# EAGLE design main (EAGLE 9.6.2)
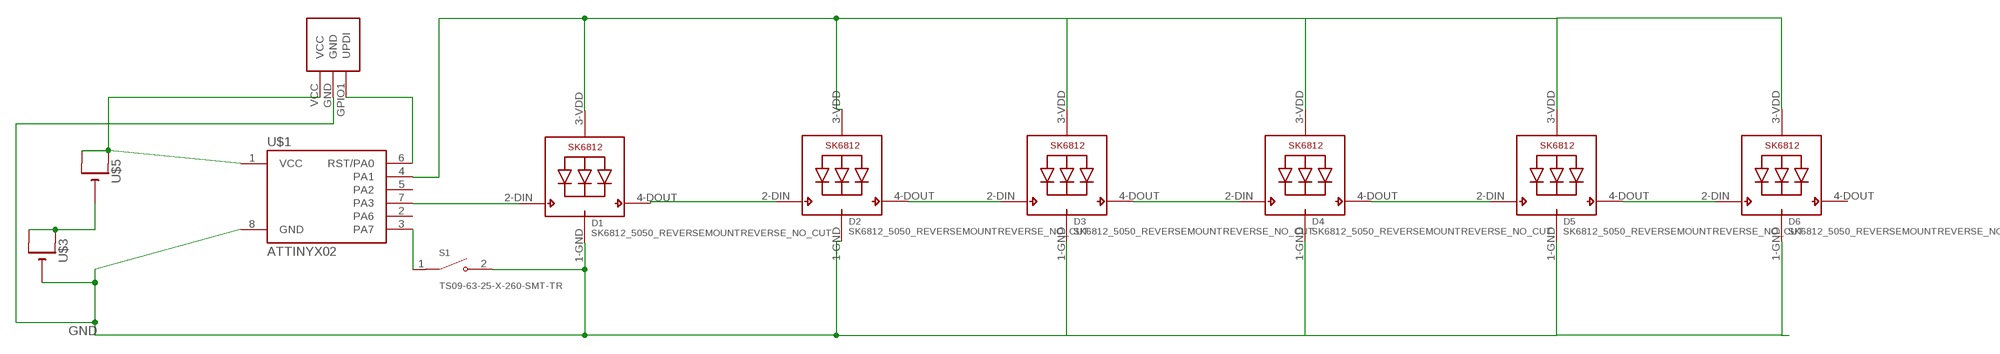
[diagram p0: schematic, sheet 1]

## Parts
D1  SK6812_5050_REVERSEMOUNTREVERSE_NO_CUT  [SK6812_REVERSE_NO_CUT]
D2  SK6812_5050_REVERSEMOUNTREVERSE_NO_CUT  [SK6812_REVERSE_NO_CUT]
D3  SK6812_5050_REVERSEMOUNTREVERSE_NO_CUT  [SK6812_REVERSE_NO_CUT]
D4  SK6812_5050_REVERSEMOUNTREVERSE_NO_CUT  [SK6812_REVERSE_NO_CUT]
D5  SK6812_5050_REVERSEMOUNTREVERSE_NO_CUT  [SK6812_REVERSE_NO_CUT]
D6  SK6812_5050_REVERSEMOUNTREVERSE_NO_CUT  [SK6812_REVERSE_NO_CUT]
S1  TS09-63-25-X-260-SMT-TR  [SW_TS09-63-25-X-260-SMT-TR]
U$1  ATTINYX02  [SOIC08_JEDEC_150MIL]
U$2  SAO  [SAO_SMD]
U$3  CR2032SMT  [CR2032-SMD]
U$5  CR2032SMT  [CR2032-SMD]

## Nets
GND: D1.1-GND(GND) D2.1-GND(GND) D3.1-GND(GND) D4.1-GND(GND) D5.1-GND(GND) D6.1-GND(GND) S1.2 U$1.8(GND) U$2.GND U$3.-
N$2: D1.4-DOUT(DO) D2.2-DIN(DI)
N$3: D1.2-DIN(DI) U$1.7(PA3)
N$5: D3.4-DOUT(DO) D4.2-DIN(DI)
N$6: D2.4-DOUT(DO) D3.2-DIN(DI)
N$7: S1.1 U$1.3(PA7)
N$8: D4.4-DOUT(DO) D5.2-DIN(DI)
N$9: D5.4-DOUT(DO) D6.2-DIN(DI)
N$10: U$3.+$1(+) U$3.+$2(+1) U$5.-
N$110: U$1.6(RST/PA0) U$2.GPIO1(UPDI)
VCC1: U$1.1(VCC) U$2.VCC U$5.+$1(+) U$5.+$2(+1)
VDD1: D1.3-VDD(VDD) D2.3-VDD(VDD) D3.3-VDD(VDD) D4.3-VDD(VDD) D5.3-VDD(VDD) D6.3-VDD(VDD) U$1.4(PA1)
Unconnected: D6.4-DOUT(DO) U$1.2(PA6) U$1.5(PA2)

## Library data of the parts
D1-D6 = mylibrary:SK6812_5050_REVERSEMOUNT
S1 = mylibrary:TS09-63-25-X-260-SMT-TR; MANUFACTURER: CUI Devices; MAXIMUM_PACKAGE_HEIGHT: 2.5 mm; PARTREV: 1.0; STANDARD: Manufacturer Recommendations
U$1 = mylibrary:ATTINYX02
U$2 = mylibrary:SAO
U$3 U$5 = adafruit:CR2032

## Board
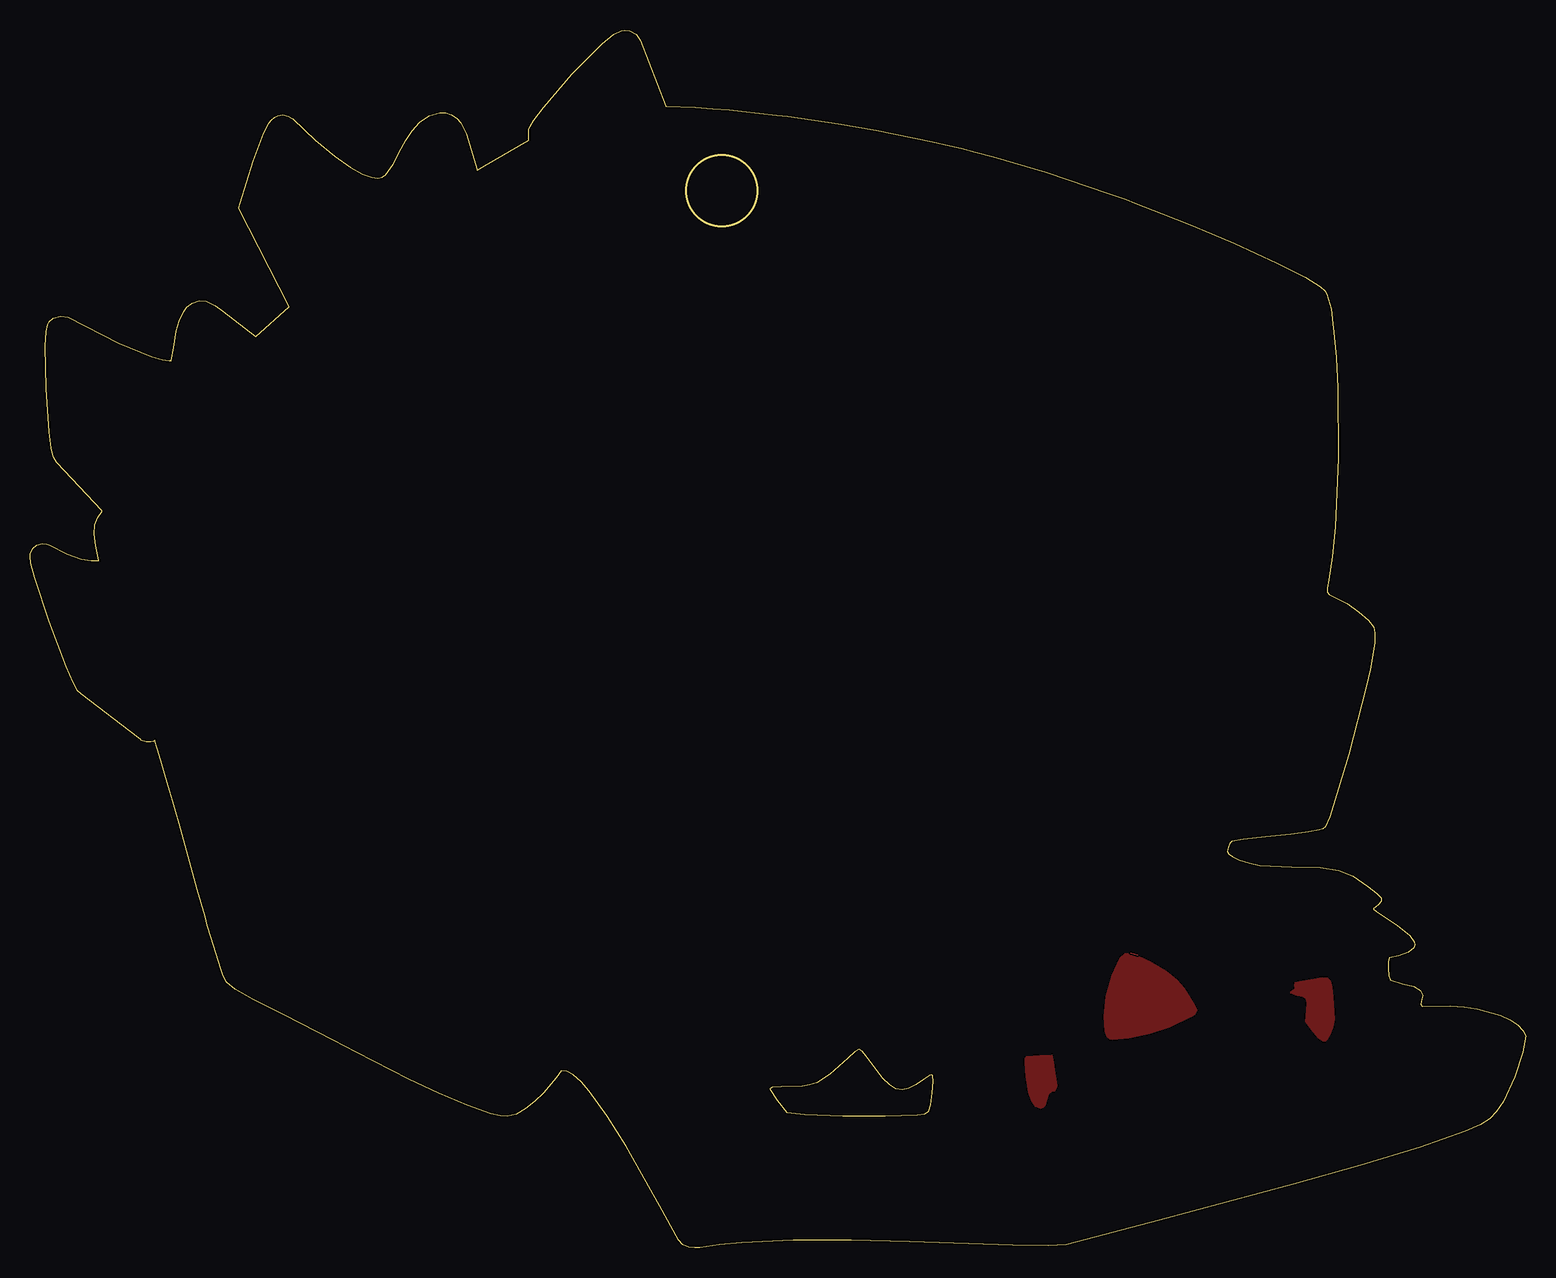
[diagram p1: board, top side]
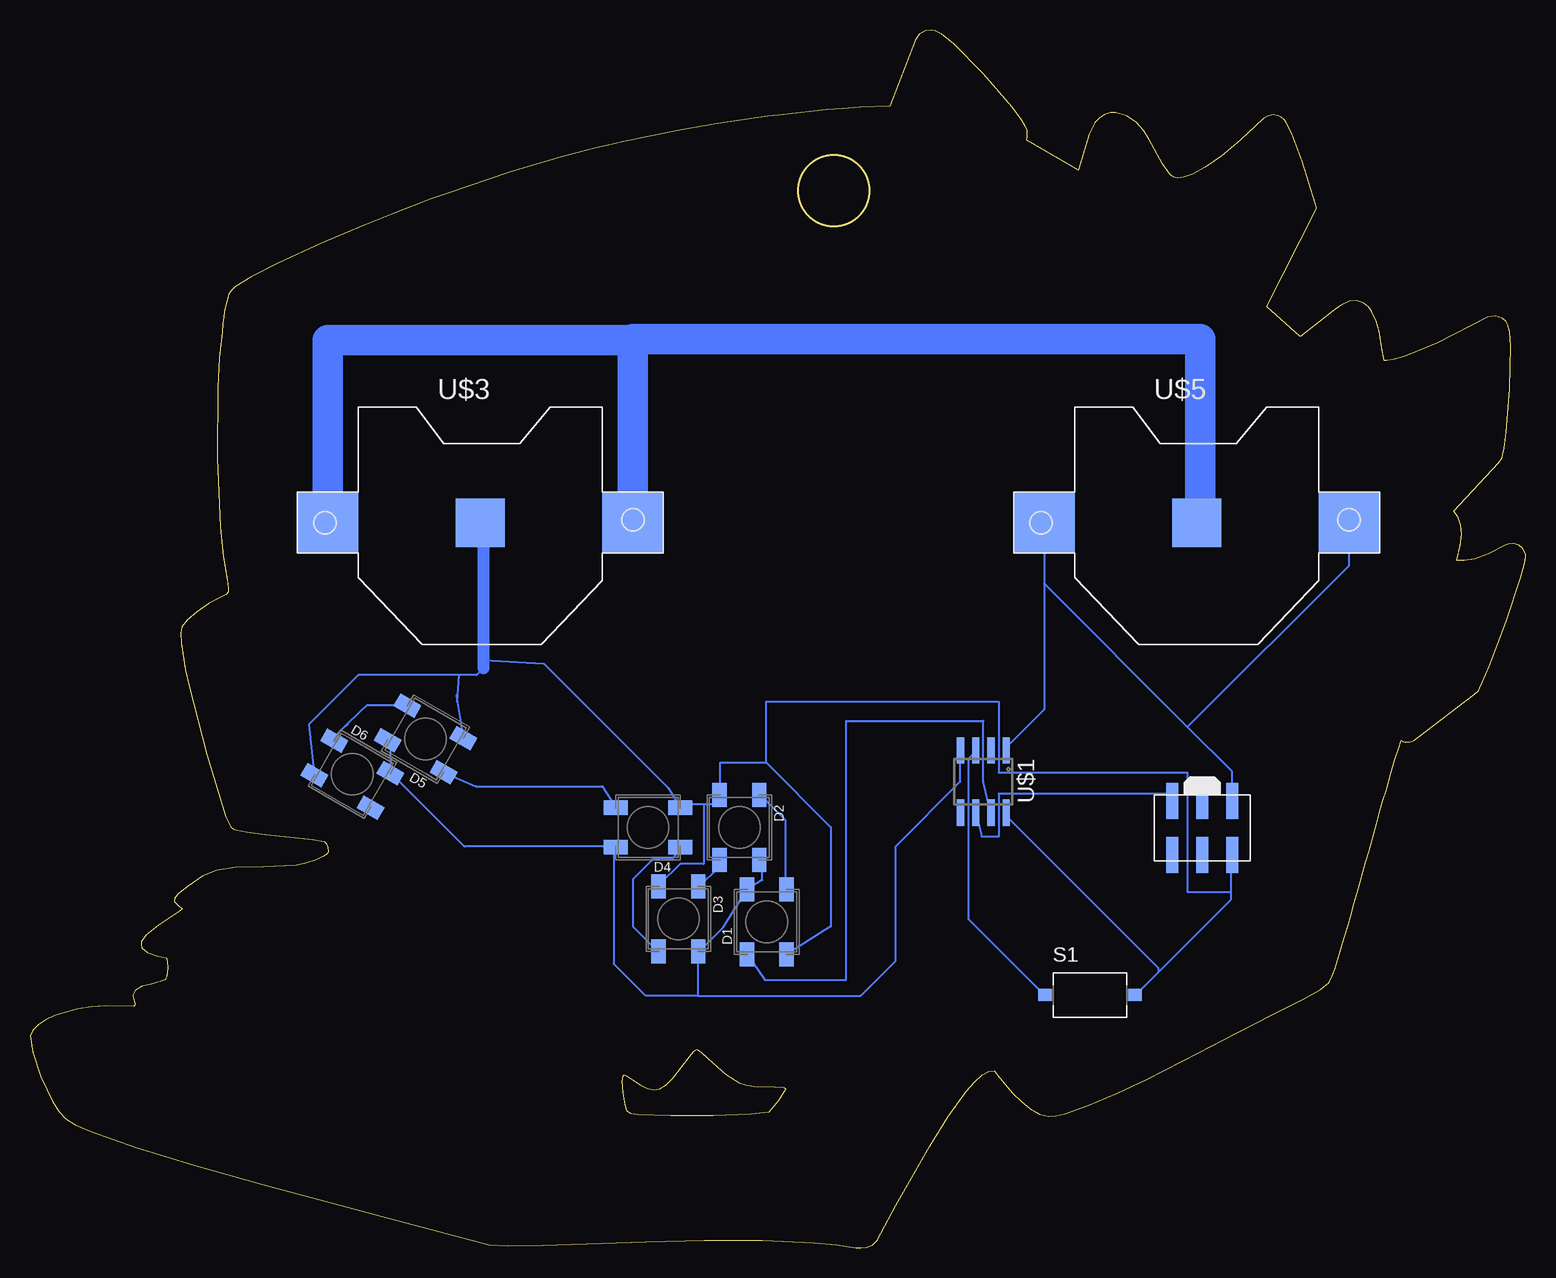
[diagram p2: board, bottom side, seen from below]

Size 124.64 x 101.54 mm. Coordinates in mm from the lower left corner, seen from the top.
Outline: 49.55,101.54 49.25,101.48 48.64,101.19 47.67,100.39 45.2,97.88 42.8,95.12 41.99,94.02 41.71,93.53 41.56,93.23 41.54,92.61 41.58,92.37 37.91,90.23 37.27,89.84 36.35,92.88 35.9,93.82 35.56,94.2 35.12,94.48 34.64,94.64 34.15,94.65 33.28,94.4 32.46,93.84 31.84,93.15 31.35,92.4 30.96,91.65 30.25,90.33 29.63,89.5 29.34,89.29 29,89.19 28.5,89.26 27.75,89.54 26.7,90.1 25.38,91.03 23.78,92.36 21.88,94.13 21.51,94.36 21.05,94.47 20.65,94.4 20.38,94.26 20.09,94.01 19.94,93.8 19.49,92.94 18.62,90.59 17.53,87.12 17.4,86.69 21.59,78.49 18.81,75.97 16.08,78.09 15.45,78.58 14.68,78.93 14.11,78.97 13.51,78.78 13.08,78.44 12.82,78.07 12.44,77.25 12.2,76.45 11.99,75.05 11.79,73.97 11.59,73.96 11.03,74.04 10.14,74.29 7.38,75.45 3.18,77.59 2.55,77.69 1.93,77.52 1.62,77.22 1.49,76.99 1.34,76.4 1.26,75.18 1.34,71.66 1.61,68.01 1.79,66.67 1.9,66.16 1.96,65.91 2.25,65.5 6,61.46 5.63,60.91 5.4,60.28 5.34,59.52 5.46,58.56 5.75,57.32 5.12,57.3 4.25,57.45 3.11,57.85 1.66,58.6 1.41,58.7 1.03,58.74 0.57,58.6 0.24,58.32 0.01,57.87 0,57.63 0.06,57.1 0.39,55.88 1.62,52.24 3.04,48.49 3.6,47.16 3.84,46.7 3.93,46.5 4.25,46.18 9.06,42.53 9.22,42.41 9.29,42.33 9.67,42.2 9.9,42.18 10.07,42.19 10.26,42.24 10.39,42.32 10.59,41.66 10.9,40.69 11.24,39.51 11.63,38.1 11.91,37.26 12.16,36.39 12.42,35.4 13.04,33.08 13.31,32.17 13.94,29.9 14.27,28.77 14.59,27.63 14.79,26.88 15.11,25.85 15.89,23.32 16.11,22.68 16.39,22.13 17.09,21.55 18.56,20.73 21.16,19.42 25.28,17.31 27.19,16.29 31.58,14.07 34.07,12.89 36.44,11.88 38.41,11.18 39.18,11 39.76,10.96 40.51,11.16 41.29,11.61 42.05,12.22 42.75,12.91 43.85,14.18 44.28,14.75 44.74,14.74 45.29,14.42 45.92,13.85 46.61,13.06 48.11,10.98 49.67,8.49 52.48,3.53 54.04,0.65 54.41,0.28 54.9,0.08 55.4,0 55.82,0.03 57.43,0.28 59.3,0.46 63.62,0.64 68.42,0.64 73.32,0.54 81.9,0.24 84.84,0.19 86.37,0.29 94.09,2.33 105.29,5.31 110.9,6.89 115.84,8.4 119.59,9.72 120.87,10.28 121.65,10.76 122.21,11.36 122.75,12.21 123.73,14.28 124.41,16.32 124.64,17.7 124.41,18.16 123.97,18.61 123.34,19.02 122.55,19.38 120.6,19.94 119.5,20.1 118.35,20.17 116.01,20.13 115.88,20.33 115.94,20.56 116.07,21.06 115.87,21.47 115.32,21.79 114.42,22.03 113.37,22.35 113.24,22.7 113.18,23.31 113.18,23.89 113.28,24.17 114.06,24.35 114.87,24.63 115.31,25.02 115.38,25.26 115.35,25.51 114.99,26.07 113.93,26.89 112.81,27.63 112.19,28.05 111.94,28.27 112.34,28.61 112.61,28.9 112.6,29.18 112.24,29.56 111.49,30.15 110.23,31.02 109.07,31.5 107.54,31.71 105.15,31.78 102.47,31.91 101.59,32.09 100.79,32.37 100.19,32.63 99.88,32.84 99.78,33.07 99.84,33.39 99.96,33.71 100.14,33.9 101.09,34.07 102.99,34.27 105.04,34.49 106.55,34.69 107.45,34.87 107.72,34.95 107.92,35.11 108.31,35.94 109.91,41.13 111.36,46.79 111.69,48.25 112.05,50.44 112.08,51.26 111.99,51.76 111.53,52.36 110.74,53.04 109.75,53.71 108.69,54.28 108.29,54.47 108.11,54.68 108.1,55.03 108.22,55.67 108.53,57.66 108.77,60.12 109.03,65.85 109,71.67 108.86,74.23 108.63,76.37 108.58,77.05 108.42,78.25 108.07,79.53 107.88,79.82 107.54,80.14 106.26,80.95 103.96,82.11 100.35,83.76 98.46,84.56 96.68,85.32 94.36,86.24 92.12,87.12 91.31,87.43 89.93,87.91 84.67,89.67 80.27,90.99 78.81,91.36 77.6,91.68 76.63,91.91 75.2,92.24 70.5,93.21 67.37,93.75 63.16,94.34 62.25,94.45 59.33,94.77 58.25,94.88 56.9,94.99 55.45,95.09 52.98,95.2 50.87,100.68 50.53,101.17 50,101.49 49.55,101.54
Outline: 49.55,101.54 49.55,101.54
Outline: 61.85,13.41 61.65,13.29 62.26,12.33 63.07,11.32 64.56,11.14 67.71,11.03 71.26,11.01 73.94,11.11 74.56,11.19 74.88,11.39 75.05,11.92 75.18,12.95 75.27,13.91 75.22,14.37 75.13,14.43 74.98,14.39 74.49,14.07 73.81,13.6 73.21,13.3 72.67,13.19 72.16,13.29 71.64,13.6 71.07,14.14 69.68,15.96 69.35,16.41 69.08,16.55 68.74,16.36 68.15,15.83 66.67,14.5 65.54,13.78 64.98,13.6 64.33,13.49 62.6,13.44 61.85,13.41
Outline: circle at 57.65,88.15 radius 2.96
Copper layers (1*16): Top 0.035mm / dielectric 1.5mm / Bottom 0.035mm
Design rules "default": minimum track width 6mil, minimum drill 0.35mm, track to track 6mil, track to pad 6mil, pad to pad 6mil, via to via 6mil, smd to smd 6mil, copper to edge 40mil, drill to drill 6mil, minimum pad ring 10mil, minimum via ring 8mil, stop-mask expansion 4mil, vias tented up to drill 0mil, thermal gap 10mil
bRestrict: area 61.7,25.6 to 65.3,29.2; area 71.3,33.3 to 74.9,36.9; area 68.8,25.6 to 72.4,29.2; area 89.9,40.6 to 93.5,44.2; area 95.7,37.6 to 99.3,41.2

### Footprints (pad centres in the part's own frame; a part is rotated, then mirrored left to right if it is on the bottom)
SK6812_REVERSE_NO_CUT = smd 2 x 1.2: 1-GND -2.7,-1.65; 2-DIN -2.7,1.65; 3-VDD 2.7,1.65; 4-DOUT 2.7,-1.65
SW_TS09-63-25-X-260-SMT-TR = smd 1.1 x 1: 1 -3.75,0; 2 3.75,0
SOIC08_JEDEC_150MIL = smd 0.6 x 2.2: 1 -1.905,-2.6; 2 -0.635,-2.6; 3 0.635,-2.6; 4 1.905,-2.6; 5 1.905,2.6; 6 0.635,2.6; 7 -0.635,2.6; 8 -1.905,2.6
SAO_SMD = smd 1 x 3: GND 5.5,1.5; GPIO1 0.5,6; GPIO2 0.5,1.5; SCL 3,1.5; SDA 3,6; VCC 5.5,6
CR2032-SMD = smd 5.08 x 5.08: +$1 -12.7,0; +$2 12.7,0 | smd 4.064 x 4.064: - 0,0

### Placement (x,y rotation side)
D1  63.24,27.19 90 bottom
D2  65.52,35.07 270 bottom
D3  70.6,27.45 270 bottom
D4  73.14,35.07 180 bottom
D5  91.68,42.43 150 bottom
D6  97.78,39.5 330 bottom
S1  36.31,21.1 0 bottom
U$1  45.2,38.88 180 bottom
U$2  29.96,31.26 0 bottom
U$3  87.11,60.47 0 bottom
U$5  27.42,60.47 0 bottom

### Tracks (layer width: path | path; a pad name or v marks a point on that pad's centre or on a via)
GND
  Bottom 0.152: 30.6,23 24.56,29.03 24.56,29.67 | 30.6,23 32.5,21.1 S1.2 | 24.56,29.67 24.56,32.53 U$2.GND | 30.6,23 30.6,23.32 43.3,36.02 U$1.8 | 63.3,40.46 57.9,35.07 57.9,26.8 D1.1-GND | 63.3,40.46 67.11,40.46 67.11,37.92 D2.1-GND 67.43,37.61 67.43,36.97 68.51,36.97 | 68.51,36.97 70.28,36.97 D4.1-GND 71.46,38.33 81.84,48.72 86.86,49.04 | 68.51,36.97 68.51,32.02 70.47,32.02 72.19,30.3 D3.1-GND | 86.86,48.34 87.43,47.77 88.89,47.77 | U$3.- 86.86,60.21 | 89.12,46.08 89.02,45.5 | 89.02,45.5 D5.1-GND | 88.89,47.77 97.27,47.77 101.4,43.64 D6.1-GND | 24.56,29.67 28.18,29.67 28.18,39.64 43.93,39.64 43.93,45.54 63.3,45.54 63.3,40.46 | 89.02,45.5 88.89,47.77
  Bottom 1.016: 86.86,60.21 86.86,49.04 86.86,48.34
N$1
  Top 0.025: 91.72,24.62 92.3,24.44
N$2
  Bottom 0.152: D1.4-DOUT 61.71,30.02 61.71,35.7 63.62,37.61 D2.2-DIN
N$3
  Bottom 0.152: 44.57,35.7 U$1.7 45.2,38.88 45.2,43.96 56.63,43.96 56.63,22.37 63.41,22.37 D1.2-DIN 64.82,24.65
N$4
  pour Top: 89.62,18.05 89.52,19.33 89.7,20.97 90.18,22.71 90.86,24.17 91.28,24.57 91.57,24.62 91.92,24.57 93.22,23.95 94.63,23.12 95.57,22.34 96.14,21.7 96.69,20.81 97.01,20.27 97.21,19.81 97.05,19.5 96.75,19.28 94.97,18.39 93.3,17.84 91.54,17.49 90.17,17.35 90.03,17.39 90.03,17.39 89.79,17.62
N$5
  Bottom 0.152: D3.4-DOUT 72.51,24.91 74.41,26.81 74.41,30.75 72.76,32.4 71.08,32.4 D4.2-DIN
N$6
  Bottom 0.152: D3.2-DIN 68.7,30.3 67.43,31.57 67.43,32.21 D2.4-DOUT
N$7
  Bottom 0.152: S1.1 40.12,21.1 46.47,27.45 46.47,40.78 45.84,41.42 U$1.3
N$8
  Bottom 0.152: D4.4-DOUT 76.94,38.49 87.49,38.49 D5.2-DIN
N$9
  Bottom 0.152: D6.2-DIN 99.29,42.6 98.35,43.51 | 98.35,43.51 98.18,43.68 | 97.18,44.68 97.09,44.76 | 97.09,44.76 96.58,45.21 D5.4-DOUT | 97.09,44.76 98.35,43.51
N$10
  Bottom 0.152: U$5.- 27.1,60.78 | 74.41,71.9 74.41,75.77
  Bottom 2.54: 27.1,60.78 27.1,75.77 74.41,75.77 | U$3.+$2 74.41,71.9 74.41,75.71 99.81,75.71 U$3.+$1
N$11
  pour Top: 105.62,21.04 105.04,21.25 105.04,21.36 105.23,21.48 105.42,21.63 105.42,21.88 105.42,22.14 105.76,22.23 106.72,22.4 107.7,22.56 108.11,22.53 108.34,22.29 108.46,21.78 108.57,20.92 108.67,19.05 108.57,18.43 108.36,17.85 108.07,17.34 107.93,17.23 107.78,17.21 107.4,17.49 106.81,18.2 106.32,18.85 106.39,19.8 106.43,20.43 106.37,20.76 106.12,20.92
N$12
  pour Top: 83.02,14.31 82.92,15.44 82.96,15.81 83.05,15.97 84.17,16.06 85.15,16.11 85.27,15.5 85.4,14.58 85.52,13.86 85.56,13.54 85.5,13.27 85.35,13.08 85.12,13.01 84.85,12.82 84.73,12.39 84.58,11.85 84.41,11.68 84.23,11.61 83.83,11.78 83.47,12.26 83.24,12.98
N$110
  Bottom 0.152: 45.84,36.34 U$1.6 45.33,34.3 43.93,34.3 43.93,37.86 29.64,37.86 29.64,37.29 U$2.GPIO1
VCC1
  Bottom 0.152: U$5.+$1 40.12,55.39 | 40.12,55.39 40.12,44.91 43.3,41.73 U$1.1 | 40.12,55.39 28.18,43.45 | 28.18,43.45 24.46,39.73 U$2.VCC | 28.18,43.45 14.72,56.91 U$5.+$2
VDD1
  Bottom 0.152: 94.32,41.64 94.75,42.07 D5.3-VDD | 94.72,42.04 94.61,41.88 D6.3-VDD 94.47,39.5 88.44,33.48 76,33.48 D4.3-VDD 76,33.26 76,23.7 73.33,21.03 69.01,21.03 | D2.3-VDD 63.62,32.21 63.62,30.68 D1.3-VDD 66.86,26.74 68.7,24.91 D3.3-VDD 69.01,24.59 69.01,21.03 | 69.01,21.03 55.42,21.03 52.5,23.95 52.5,33.48 47.11,38.88 U$1.4